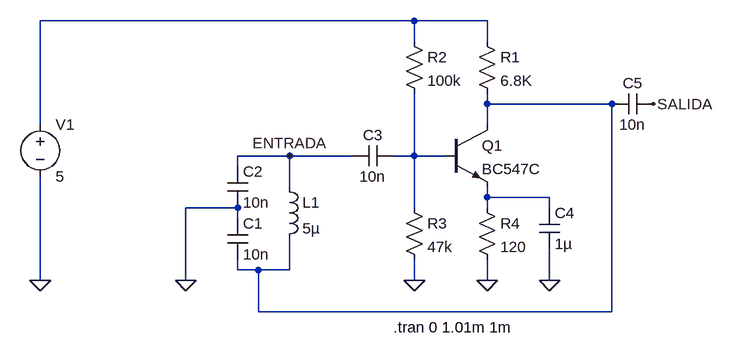
[diagram p0: schematic transistor-oscilador-LC.asc]
transistor-oscilador-LC.asc, the LTspice schematic file:
Version 4
SHEET 1 1156 680
WIRE 96 -32 -480 -32
WIRE 208 -32 96 -32
WIRE 96 0 96 -32
WIRE 208 0 208 -32
WIRE 208 96 208 80
WIRE 400 96 208 96
WIRE -480 128 -480 -32
WIRE 208 128 208 96
WIRE -96 176 -176 176
WIRE 0 176 -96 176
WIRE 96 176 96 80
WIRE 96 176 64 176
WIRE 144 176 96 176
WIRE -176 192 -176 176
WIRE -96 224 -96 176
WIRE 208 240 208 224
WIRE 304 240 208 240
WIRE -176 256 -256 256
WIRE 96 256 96 176
WIRE 208 256 208 240
WIRE 304 256 304 240
WIRE -176 272 -176 256
WIRE -176 352 -176 336
WIRE -144 352 -176 352
WIRE -96 352 -96 304
WIRE -96 352 -144 352
WIRE -480 368 -480 208
WIRE -256 368 -256 256
WIRE 96 368 96 336
WIRE 208 368 208 336
WIRE 304 368 304 320
WIRE -144 416 -144 352
WIRE 400 416 400 96
WIRE 400 416 -144 416
FLAG 96 368 0
FLAG 208 368 0
FLAG 304 368 0
FLAG -480 368 0
FLAG -256 368 0
FLAG 464 96 SALIDA
FLAG -96 176 ENTRADA
SYMBOL res 192 240 R0
SYMATTR InstName R4
SYMATTR Value 120
SYMBOL res 80 240 R0
SYMATTR InstName R3
SYMATTR Value 47k
SYMBOL res 80 -16 R0
SYMATTR InstName R2
SYMATTR Value 100k
SYMBOL cap 288 256 R0
SYMATTR InstName C4
SYMATTR Value 1µ
SYMBOL cap 64 160 R90
WINDOW 0 0 32 VBottom 2
WINDOW 3 32 32 VTop 2
SYMATTR InstName C3
SYMATTR Value 10n
SYMBOL voltage -480 112 R0
WINDOW 123 0 0 Left 0
WINDOW 39 0 0 Left 0
SYMATTR InstName V1
SYMATTR Value 5
SYMBOL npn 144 128 R0
SYMATTR InstName Q1
SYMATTR Value BC547C
SYMBOL ind -112 208 R0
SYMATTR InstName L1
SYMATTR Value 5µ
SYMBOL cap -192 192 R0
SYMATTR InstName C2
SYMATTR Value 10n
SYMBOL cap -192 272 R0
SYMATTR InstName C1
SYMATTR Value 10n
SYMBOL res 192 -16 R0
SYMATTR InstName R1
SYMATTR Value 6.8K
SYMBOL cap 464 80 R90
WINDOW 0 0 32 VBottom 2
WINDOW 3 32 32 VTop 2
SYMATTR InstName C5
SYMATTR Value 10n
TEXT 64 440 Left 2 !.tran 0 1.01m 1m

The netlist it stands for:
* transistor-oscilador-LC.asc
R4 N004 0 120
R3 N003 0 47k
R2 N001 N003 100k
C4 N004 0 1µ
C3 N003 ENTRADA 10n
V1 N001 0 5
Q1 N002 N003 N004 0 BC547C
L1 ENTRADA N002 5µ
C2 ENTRADA 0 10n
C1 0 N002 10n
R1 N001 N002 6.8K
C5 SALIDA N002 10n
.model NPN NPN
.model PNP PNP
.lib standard.bjt
.tran 0 1.01m 1m
.backanno
.end